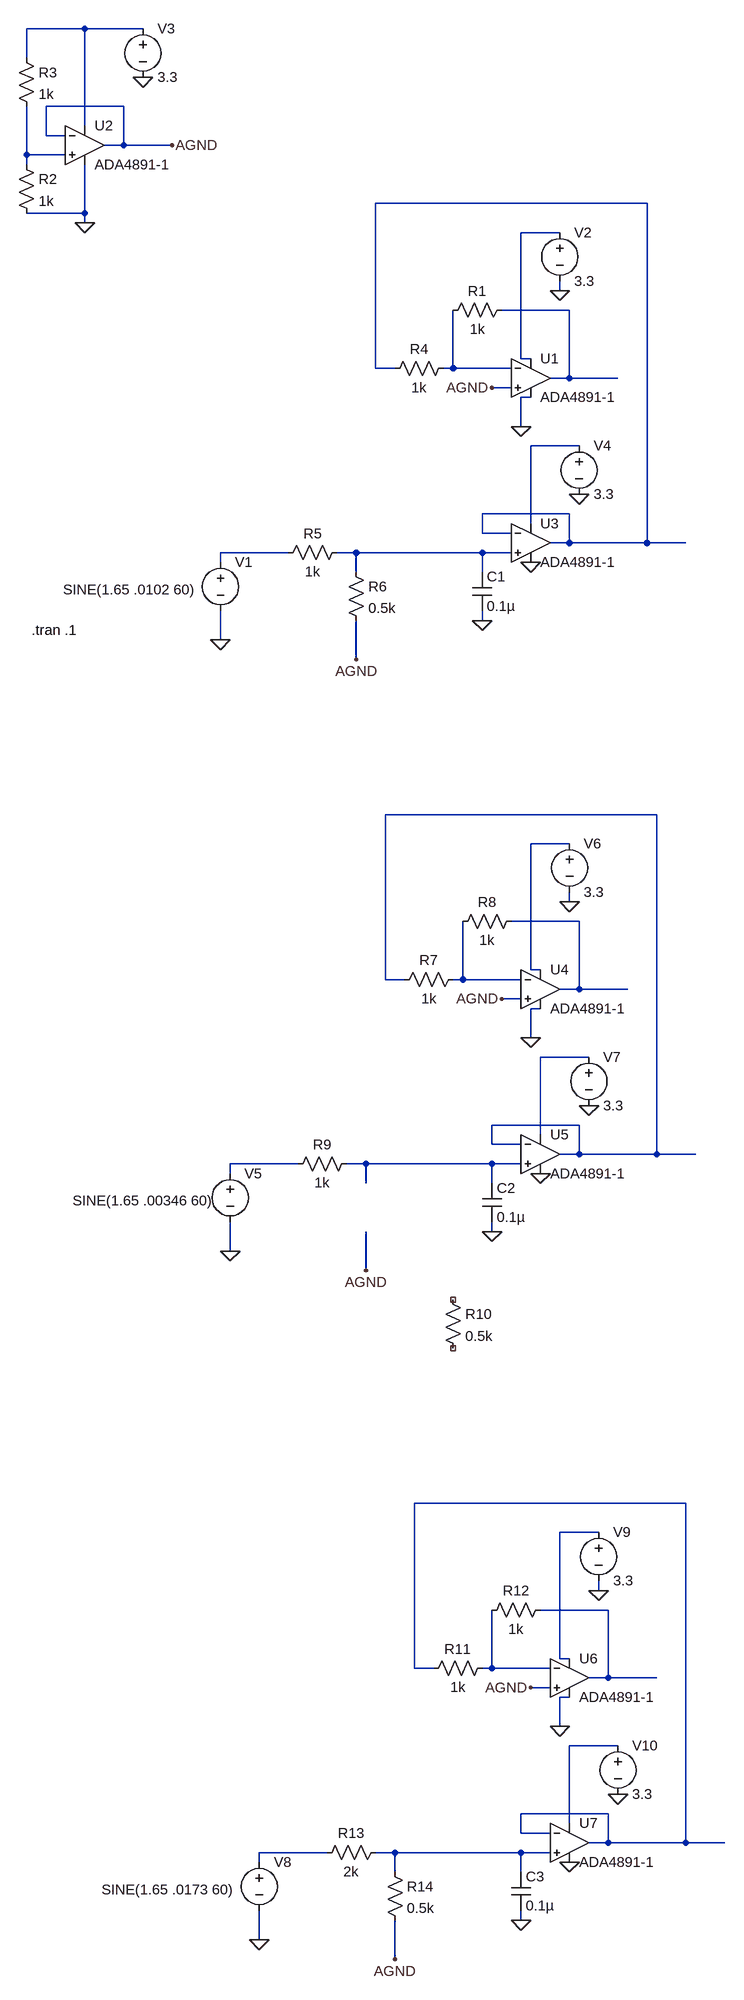
[diagram p0: schematic DAC_OP_Configs.asc]
DAC_OP_Configs.asc, the LTspice schematic file:
Version 4
SHEET 1 936 2760
WIRE -176 -560 -272 -560
WIRE -80 -560 -176 -560
WIRE -272 -512 -272 -560
WIRE -112 -432 -240 -432
WIRE -176 -400 -176 -560
WIRE -240 -384 -240 -432
WIRE -208 -384 -240 -384
WIRE -112 -368 -112 -432
WIRE -112 -368 -144 -368
WIRE -32 -368 -112 -368
WIRE -272 -352 -272 -432
WIRE -208 -352 -272 -352
WIRE -272 -336 -272 -352
WIRE 752 -272 304 -272
WIRE -176 -256 -176 -336
WIRE -176 -256 -272 -256
WIRE -176 -240 -176 -256
WIRE 608 -224 544 -224
WIRE 608 -128 608 -144
WIRE 624 -96 512 -96
WIRE 544 -16 544 -224
WIRE 560 -16 544 -16
WIRE 304 0 304 -272
WIRE 336 0 304 0
WIRE 432 0 432 -96
WIRE 432 0 416 0
WIRE 528 0 432 0
WIRE 624 16 624 -96
WIRE 624 16 592 16
WIRE 704 16 624 16
WIRE 528 32 496 32
WIRE 560 48 544 48
WIRE 544 96 544 48
WIRE 640 128 560 128
WIRE 624 240 480 240
WIRE 560 256 560 128
WIRE 480 272 480 240
WIRE 528 272 480 272
WIRE 624 288 624 240
WIRE 624 288 592 288
WIRE 752 288 752 -272
WIRE 752 288 624 288
WIRE 816 288 752 288
WIRE 160 304 48 304
WIRE 272 304 240 304
WIRE 480 304 272 304
WIRE 528 304 480 304
WIRE 48 320 48 304
WIRE 272 336 272 304
WIRE 480 336 480 304
WIRE 480 416 480 400
WIRE 48 448 48 400
WIRE 272 480 272 416
WIRE 768 736 320 736
WIRE 624 784 560 784
WIRE 624 880 624 864
WIRE 640 912 528 912
WIRE 560 992 560 784
WIRE 576 992 560 992
WIRE 320 1008 320 736
WIRE 352 1008 320 1008
WIRE 448 1008 448 912
WIRE 448 1008 432 1008
WIRE 544 1008 448 1008
WIRE 640 1024 640 912
WIRE 640 1024 608 1024
WIRE 720 1024 640 1024
WIRE 544 1040 512 1040
WIRE 576 1056 560 1056
WIRE 560 1104 560 1056
WIRE 656 1136 576 1136
WIRE 640 1248 496 1248
WIRE 576 1264 576 1136
WIRE 496 1280 496 1248
WIRE 544 1280 496 1280
WIRE 640 1296 640 1248
WIRE 640 1296 608 1296
WIRE 768 1296 768 736
WIRE 768 1296 640 1296
WIRE 832 1296 768 1296
WIRE 176 1312 64 1312
WIRE 288 1312 256 1312
WIRE 496 1312 288 1312
WIRE 544 1312 496 1312
WIRE 64 1328 64 1312
WIRE 288 1344 288 1312
WIRE 496 1344 496 1312
WIRE 496 1424 496 1408
WIRE 64 1456 64 1408
WIRE 288 1488 288 1424
WIRE 816 1872 368 1872
WIRE 672 1920 608 1920
WIRE 672 2016 672 2000
WIRE 688 2048 576 2048
WIRE 608 2128 608 1920
WIRE 624 2128 608 2128
WIRE 368 2144 368 1872
WIRE 400 2144 368 2144
WIRE 496 2144 496 2048
WIRE 496 2144 480 2144
WIRE 592 2144 496 2144
WIRE 688 2160 688 2048
WIRE 688 2160 656 2160
WIRE 768 2160 688 2160
WIRE 592 2176 560 2176
WIRE 624 2192 608 2192
WIRE 608 2240 608 2192
WIRE 704 2272 624 2272
WIRE 688 2384 544 2384
WIRE 624 2400 624 2272
WIRE 544 2416 544 2384
WIRE 592 2416 544 2416
WIRE 688 2432 688 2384
WIRE 688 2432 656 2432
WIRE 816 2432 816 1872
WIRE 816 2432 688 2432
WIRE 880 2432 816 2432
WIRE 224 2448 112 2448
WIRE 336 2448 304 2448
WIRE 544 2448 336 2448
WIRE 592 2448 544 2448
WIRE 112 2464 112 2448
WIRE 336 2480 336 2448
WIRE 544 2480 544 2448
WIRE 544 2560 544 2544
WIRE 112 2592 112 2544
WIRE 336 2624 336 2560
FLAG 48 448 0
FLAG 608 -128 0
FLAG 544 96 0
FLAG -176 -240 0
FLAG -80 -480 0
FLAG -32 -368 AGND
FLAG 496 32 AGND
FLAG 640 208 0
FLAG 560 320 0
FLAG 480 416 0
FLAG 272 480 AGND
FLAG 64 1456 0
FLAG 624 880 0
FLAG 560 1104 0
FLAG 512 1040 AGND
FLAG 656 1216 0
FLAG 576 1328 0
FLAG 496 1424 0
FLAG 288 1488 AGND
FLAG 112 2592 0
FLAG 672 2016 0
FLAG 608 2240 0
FLAG 560 2176 AGND
FLAG 704 2352 0
FLAG 624 2464 0
FLAG 544 2560 0
FLAG 336 2624 AGND
SYMBOL voltage 48 304 R0
WINDOW 123 0 0 Left 0
WINDOW 39 0 0 Left 0
WINDOW 3 -260 61 Left 2
SYMATTR InstName V1
SYMATTR Value SINE(1.65 .0102 60)
SYMBOL res 320 16 R270
WINDOW 0 32 56 VTop 2
WINDOW 3 0 56 VBottom 2
SYMATTR InstName R4
SYMATTR Value 1k
SYMBOL voltage 608 -240 R0
WINDOW 123 0 0 Left 0
WINDOW 39 0 0 Left 0
SYMATTR InstName V2
SYMATTR Value 3.3
SYMBOL res 416 -80 R270
WINDOW 0 32 56 VTop 2
WINDOW 3 0 56 VBottom 2
SYMATTR InstName R1
SYMATTR Value 1k
SYMBOL OpAmps\\ADA4891-1 -176 -432 R0
SYMATTR InstName U2
SYMBOL voltage -80 -576 R0
WINDOW 123 0 0 Left 0
WINDOW 39 0 0 Left 0
SYMATTR InstName V3
SYMATTR Value 3.3
SYMBOL res -288 -352 R0
SYMATTR InstName R2
SYMATTR Value 1k
SYMBOL res -288 -528 R0
SYMATTR InstName R3
SYMATTR Value 1k
SYMBOL OpAmps\\ADA4891-1 560 -48 R0
SYMATTR InstName U1
SYMBOL OpAmps\\ADA4891-1 560 224 R0
SYMATTR InstName U3
SYMBOL res 144 320 R270
WINDOW 0 32 56 VTop 2
WINDOW 3 0 56 VBottom 2
SYMATTR InstName R5
SYMATTR Value 1k
SYMBOL res 256 320 R0
SYMATTR InstName R6
SYMATTR Value 0.5k
SYMBOL cap 464 336 R0
SYMATTR InstName C1
SYMATTR Value 0.1µ
SYMBOL voltage 640 112 R0
WINDOW 123 0 0 Left 0
WINDOW 39 0 0 Left 0
SYMATTR InstName V4
SYMATTR Value 3.3
SYMBOL voltage 64 1312 R0
WINDOW 123 0 0 Left 0
WINDOW 39 0 0 Left 0
WINDOW 3 -260 61 Left 2
SYMATTR InstName V5
SYMATTR Value SINE(1.65 .00346 60)
SYMBOL res 336 1024 R270
WINDOW 0 32 56 VTop 2
WINDOW 3 0 56 VBottom 2
SYMATTR InstName R7
SYMATTR Value 1k
SYMBOL voltage 624 768 R0
WINDOW 123 0 0 Left 0
WINDOW 39 0 0 Left 0
SYMATTR InstName V6
SYMATTR Value 3.3
SYMBOL res 432 928 R270
WINDOW 0 32 56 VTop 2
WINDOW 3 0 56 VBottom 2
SYMATTR InstName R8
SYMATTR Value 1k
SYMBOL OpAmps\\ADA4891-1 576 960 R0
SYMATTR InstName U4
SYMBOL OpAmps\\ADA4891-1 576 1232 R0
SYMATTR InstName U5
SYMBOL res 160 1328 R270
WINDOW 0 32 56 VTop 2
WINDOW 3 0 56 VBottom 2
SYMATTR InstName R9
SYMATTR Value 1k
SYMBOL res 416 1520 R0
SYMATTR InstName R10
SYMATTR Value 0.5k
SYMBOL cap 480 1344 R0
SYMATTR InstName C2
SYMATTR Value 0.1µ
SYMBOL voltage 656 1120 R0
WINDOW 123 0 0 Left 0
WINDOW 39 0 0 Left 0
SYMATTR InstName V7
SYMATTR Value 3.3
SYMBOL voltage 112 2448 R0
WINDOW 123 0 0 Left 0
WINDOW 39 0 0 Left 0
WINDOW 3 -260 61 Left 2
SYMATTR InstName V8
SYMATTR Value SINE(1.65 .0173 60)
SYMBOL res 384 2160 R270
WINDOW 0 32 56 VTop 2
WINDOW 3 0 56 VBottom 2
SYMATTR InstName R11
SYMATTR Value 1k
SYMBOL voltage 672 1904 R0
WINDOW 123 0 0 Left 0
WINDOW 39 0 0 Left 0
SYMATTR InstName V9
SYMATTR Value 3.3
SYMBOL res 480 2064 R270
WINDOW 0 32 56 VTop 2
WINDOW 3 0 56 VBottom 2
SYMATTR InstName R12
SYMATTR Value 1k
SYMBOL OpAmps\\ADA4891-1 624 2096 R0
SYMATTR InstName U6
SYMBOL OpAmps\\ADA4891-1 624 2368 R0
SYMATTR InstName U7
SYMBOL res 208 2464 R270
WINDOW 0 32 56 VTop 2
WINDOW 3 0 56 VBottom 2
SYMATTR InstName R13
SYMATTR Value 2k
SYMBOL res 320 2464 R0
SYMATTR InstName R14
SYMATTR Value 0.5k
SYMBOL cap 528 2480 R0
SYMATTR InstName C3
SYMATTR Value 0.1µ
SYMBOL voltage 704 2256 R0
WINDOW 123 0 0 Left 0
WINDOW 39 0 0 Left 0
SYMATTR InstName V10
SYMATTR Value 3.3
TEXT -264 432 Left 2 !.tran .1

The netlist it stands for:
* DAC_OP_Configs.asc
V1 N008 0 SINE(1.65 .0102 60)
R4 N003 N006 1k
V2 N004 0 3.3
R1 N006 N005 1k
XU2 N002 AGND N001 0 AGND ADA4891-1  ; pins In+ In- V+ V- OUT
V3 N001 0 3.3
R2 N002 0 1k
R3 N001 N002 1k
XU1 AGND N006 N004 0 N005 ADA4891-1  ; pins In+ In- V+ V- OUT
XU3 N009 N003 N007 0 N003 ADA4891-1  ; pins In+ In- V+ V- OUT
R5 N008 N009 1k
R6 N009 AGND 0.5k
C1 N009 0 0.1µ
V4 N007 0 3.3
V5 N015 0 SINE(1.65 .00346 60)
R7 N010 N013 1k
V6 N011 0 3.3
R8 N013 N012 1k
XU4 AGND N013 N011 0 N012 ADA4891-1  ; pins In+ In- V+ V- OUT
XU5 N016 N010 N014 0 N010 ADA4891-1  ; pins In+ In- V+ V- OUT
R9 N015 N016 1k
R10 NC_01 NC_02 0.5k
C2 N016 0 0.1µ
V7 N014 0 3.3
V8 N022 0 SINE(1.65 .0173 60)
R11 N017 N020 1k
V9 N018 0 3.3
R12 N020 N019 1k
XU6 AGND N020 N018 0 N019 ADA4891-1  ; pins In+ In- V+ V- OUT
XU7 N023 N017 N021 0 N017 ADA4891-1  ; pins In+ In- V+ V- OUT
R13 N022 N023 2k
R14 N023 AGND 0.5k
C3 N023 0 0.1µ
V10 N021 0 3.3
.tran .1
.backanno
.end